# Altium project Sword.PrjPcb
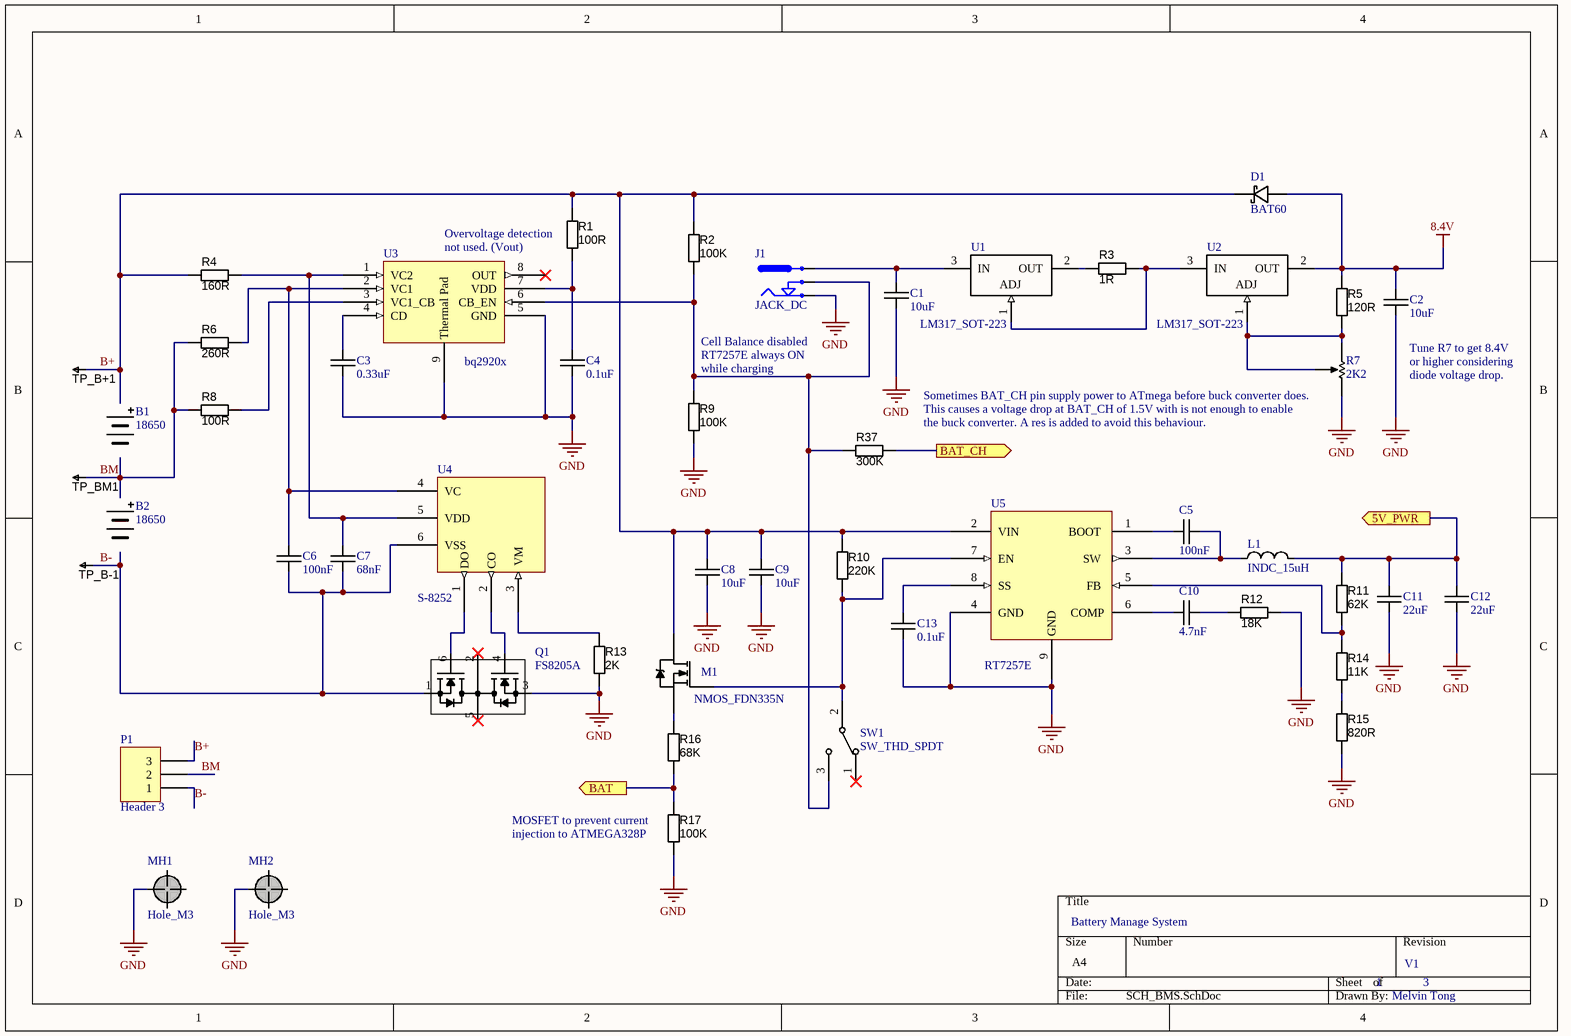
[diagram p0: SCH_BMS.SchDoc]
3 sheets, 112 parts. Net scope: global (net labels, ports and power ports of the same name join across sheets).
Board file: PCB_Sword.PcbDoc
Sheets:
  SCH_BMS.SchDoc
  SCH_System.SchDoc
  SCH_Modules.SchDoc

## Sheet SCH_BMS.SchDoc
size A4

### Parts
B1  18650
B2  18650
C1  10uF  [CAP_0805]
C2  10uF  [CAP_1206]
C3  0.33uF  [CAP_0805]
C4  0.1uF  [CAP_0805]
C5  100nF  [CAP_0805]
C6  100nF  [CAP_0805]
C7  68nF  [CAP_0805]
C8  10uF  [CAP_1206]
C9  10uF  [CAP_1206]
C10  4.7nF  [CAP_0805]
C11  22uF  [CAP_1206]
C12  22uF  [CAP_1206]
C13  0.1uF  [CAP_0805]
D1  BAT60  [SOD323]
J1  JACK_DC  [DC-004]
L1  INDC_15uH  [IND_15uH]
M1  NMOS_FDN335N  [SOT23_213]
MH1  Hole_M3  [Hole_M3]
MH2  Hole_M3  [Hole_M3]
P1  Header 3  [HDR1X3]
Q1  FS8205A  [SOT23-6]
R1  100R  [RESC3216X70N]
R2  100K  [RESC3216X70N]
R3  value 1R  [RESC6332X70N]  (hidden comment: RES_1R_2512)
R4  160R  [RESC3216X70N]
R5  120R  [RESC3216X70N]
R6  260R  [RESC3216X70N]
R7  2K2  [RES_VAR]
R8  100R  [RESC3216X70N]
R9  100K  [RESC3216X70N]
R10  220K  [RESC3216X70N]
R11  62K  [RESC3216X70N]
R12  18K  [RESC3216X70N]
R13  2K  [RESC3216X70N]
R14  11K  [RESC3216X70N]
R15  820R  [RESC3216X70N]
R16  68K  [RESC3216X70N]
R17  100K  [RESC3216X70N]
R37  300K  [RESC3216X70N]
SW1  SW_THD_SPDT  [3P_header]
TP_B+1  TESTPOINT  [TP-R20]  (value not drawn)  (no BOM)
TP_B-1  TESTPOINT  [TP-R20]  (value not drawn)  (no BOM)
TP_BM1  TESTPOINT  [TP-R20]  (value not drawn)  (no BOM)
U1  LM317_SOT-223  [SOT223]
U2  LM317_SOT-223  [SOT223]
U3  bq2920x  [bq2920x]
U4  S-8252  [SOT23-6]
U5  RT7257E  [RT7257E]

### Ports
5V_PWR (out), BAT (out), BAT_CH (out)

### Nets
5V_PWR: C11.1 C12.1 L1.2 R11.1 ; port 5V_PWR
8.4V: C2.1 D1.A R5.1 U2.2(OUT)
GND: C1.2 C2.2 C3.2 C4.2 C8.2 C9.2 C11.2 C12.2 C13.2 J1.1 MH1.MH MH2.MH Q1.3(D2) R7.3(CW) R9.1 R12.2 R13.2 R15.2 R17.2 U3.5(GND) U3.9(Thermal_Pad) U5.4(GND) U5.9(GND)
B+: C8.1 C9.1 D1.K M1.3(D) P1.3 R1.2 R2.2 R4.1 R10.1 TP_B+1.1 U5.2(VIN)
B-: C6.2 C7.2 P1.1 Q1.1(S1) TP_B-1.1 U4.6(VSS)
BAT: R16.2 R17.1 ; port BAT
BAT_CH: R37.2 ; port BAT_CH
BM: P1.2 R6.1 R8.1 TP_BM1.1
NetC1_1: C1.1 J1.2 U1.3(IN)
NetC3_1: C3.1 U3.4(CD)
NetC4_1: C4.1 R1.1 U3.7(VDD)
NetC5_1: C5.1 U5.1(BOOT)
NetC5_2: C5.2 L1.1 U5.3(SW)
NetC6_1: C6.1 R6.2 U3.2(VC1) U4.4(VC)
NetC7_1: C7.1 R4.2 U3.1(VC2) U4.5(VDD)
NetC10_1: C10.1 U5.6(COMP)
NetC10_2: C10.2 R12.1
NetC13_1: C13.1 U5.8(SS)
NetJ1_3: J1.3 R2.1 R9.2 R37.1 SW1.3 U3.6(CB_EN)
NetM1_1: M1.1(G) R10.2 SW1.2 U5.7(EN)
NetM1_2: M1.2(S) R16.1
NetQ1_4: Q1.4(G2) U4.2(CO)
NetQ1_6: Q1.6(G1) U4.1(DO)
NetR3_1: R3.1 U1.2(OUT)
NetR3_2: R3.2 U1.1(ADJ) U2.3(IN)
NetR5_2: R5.2 R7.1(CCW) R7.2(WIPER) U2.1(ADJ)
NetR8_2: R8.2 U3.3(VC1_CB)
NetR11_2: R11.2 R14.1 U5.5(FB)
NetR13_1: R13.1 U4.3(VM)
NetR14_2: R14.2 R15.1

Not connected (* = marked no-connect by the designer): Q1 2(D1)* 5(D2)*; SW1 1*; U3 8(OUT)*

### Notes on the sheet
- (near R1) Overvoltage detection
- not used. (Vout)
- Cell Balance disabled
- (near R9) while charging
- RT7257E always ON
- (near C2) Tune R7 to get 8.4V
- or higher considering
- diode voltage drop.
- (near R7) This causes a voltage drop at BAT_CH of 1.5V with is not enough to enable
- (near R7) Sometimes BAT_CH pin supply power to ATmega before buck converter does.
- the buck converter. A res is added to avoid this behaviour.
- (near R17) MOSFET to prevent current
- (near R17) injection to ATMEGA328P
- Battery Manage System
- 1
- V1
- 3
- Melvin Tong

### Library data of the parts
B1 B2 = Battery_18650
C1 C2 C8 C9 = CAP_10uF: SMD 0805/1206
C3 = CAP_330nF: SMD 0805
C4 C6 C7 C13 = CAP_0.1uF: SMD 0805
C5 = CAP_100nF: SMD 0805
C10 = CAP_4.7nF: SMD 0805
C11 C12 = CAP_22uF: SMD 1206
D1 = BAT60: Schottky Diode 3A, Vf~0.24V, Vr=10V
L1 = INDC_15uH: 15uH ±20% 4.2A 28.4mΩ SMD,12.5x12.5x6.5mm Power Inductors
P1 = Header 3: Header, 3-Pin; LatestRevisionDate: 17-Jul-2002; LatestRevisionNote: Re-released for DXP Platform.; Publisher: Altium Limited
Q1 = FS8205A: NMOS, Drain-Connected, Imax 6A
R1 R8 = RES_100R: Resistor SMD, 1206; Value: N/A
R2 R9 R17 = RES_100K: Resistor SMD, 1206; Value: N/A
R3 = RES_1R_2512: Resistor SMD 1Ω ±5% 2W ±400ppm/℃ 2512; Ratings: 1W; SCDType: spec; Tolerance: ±5%; Material: Thick Film; Package / Case: 2512 (6332 metric)
R4 = RES_160R: Resistor SMD, 1206; Value: N/A
R5 = RES_120R: Resistor SMD, 1206; Value: N/A
R6 = RES_260R: Resistor SMD, 1206; Value: N/A
R7 = RES_Var_2K2: Resistor SMD Variable
R10 = RES_220K: Resistor SMD, 1206; Value: N/A
R11 = RES_62K: Resistor SMD, 1206; Value: N/A
R12 = RES_18K: Resistor SMD, 1206; Value: N/A
R13 = RES_2K: Resistor SMD, 1206; Value: N/A
R14 = RES_11K: Resistor SMD, 1206; Value: N/A
R15 = RES_820R: Resistor SMD, 1206; Value: N/A
R16 = RES_68K: Resistor SMD, 1206; Value: N/A
R37 = RES_300K: Resistor SMD, 1206; Value: N/A
SW1 = SW_THD_SPDT: Switch 2 position
TP_B+1 TP_B-1 TP_BM1 = TESTPOINT: SMD test pin
U1 U2 = LM317_SOT-223: Linear Voltage Regulator
U3 = bq2920x: Automatic Cell Balance 2S Li-Ion Battery
U4 = S-8252: Battery protection IC for 2S battery pack
U5 = RT7257E: DC/DC Buck Converter, 3A, 4.5V-17V Vin

## Sheet SCH_System.SchDoc
size A4
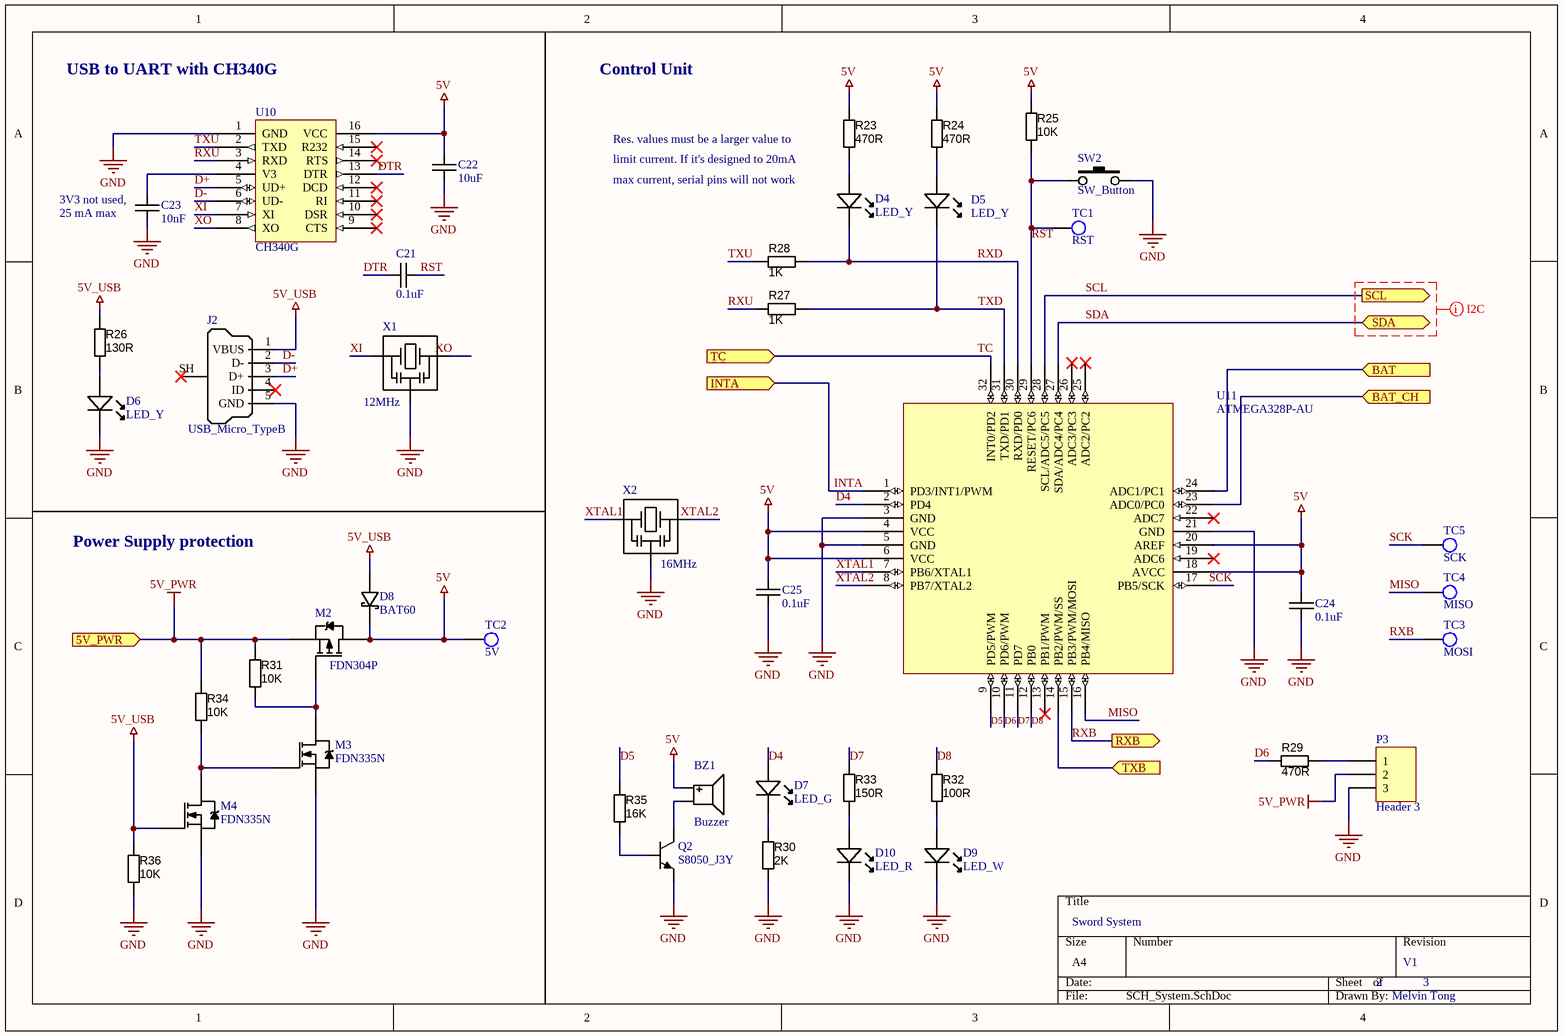
[diagram p1: SCH_System.SchDoc]

### Parts
BZ1  Buzzer  [Buzzer]
C21  0.1uF  [CAP_0805]
C22  10uF  [CAP_1206]
C23  10nF  [CAP_0805]
C24  0.1uF  [CAP_0805]
C25  0.1uF  [CAP_0805]
D4  LED_Y  [LED-0603-YELLOW]
D5  LED_Y  [LED-0603-YELLOW]
D6  LED_Y  [LED-0603-YELLOW]
D7  LED_G  [LED_0805]
D8  BAT60  [SOD323]
D9  LED_W  [LED_0805]
D10  LED_R  [LED_0805]
J2  USB_Micro_TypeB  [USB_Micro_TypeB]
M2  FDN304P  [SOT23_213]
M3  FDN335N  [SOT23_213]
M4  FDN335N  [SOT23_213]
P3  Header 3  [HDR1X3]
Q2  S8050_J3Y  [SOT23_213]
R23  470R  [RESC3216X70N]
R24  470R  [RESC3216X70N]
R25  10K  [RESC3216X70N]
R26  130R  [RESC3216X70N]
R27  1K  [RESC3216X70N]
R28  1K  [RESC3216X70N]
R29  470R  [RESC3216X70N]
R30  2K  [RESC3216X70N]
R31  10K  [RESC3216X70N]
R32  100R  [RESC3216X70N]
R33  150R  [RESC3216X70N]
R34  10K  [RESC3216X70N]
R35  16K  [RESC3216X70N]
R36  10K  [RESC3216X70N]
SW2  SW_Button  [Button_4x4x1.5]
TC1  RST  [TP_15]
TC2  5V  [TP_15]
TC3  MOSI  [TP_15]
TC4  MISO  [TP_15]
TC5  SCK  [TP_15]
U10  CH340G  [CH340G]
U11  ATMEGA328P-AU  [ATMEGA328P-AU]
X1  12MHz  [XTAL_3.2x1.6]
X2  16MHz  [XTAL_16MHz]

### Ports
5V_PWR (in), BAT (in), BAT_CH (in), INTA (in), RXB (out), SCL (out), SDA (bidir), TC (in), TXB (in)

### Nets
5V: BZ1.1(Positive) C22.1 C24.2 C25.2 D8.K M2.3(D) R23.2 R24.1 R25.1 TC2.1 U10.16(VCC) U11.4(VCC) U11.6(VCC) U11.18(AVCC) U11.20(AREF)
5V_PWR: M2.2(S) P3.2 R31.1 R34.1 ; port 5V_PWR
5V_USB: D8.A J2.1(VBUS) M4.1(G) R26.2 R36.1
GND: C22.2 C23.2 C24.1 C25.1 D6.K D9.K D10.K J2.5(GND) M3.2(S) M4.2(S) P3.3 Q2.2(E) R30.2 R36.2 SW2.2 U10.1(GND) U11.3(GND) U11.5(GND) U11.21(GND) X1.2(GND) X2.2(GND)
BAT: U11.24(ADC1/PC1) ; port BAT
BAT_CH: U11.23(ADC0/PC0) ; port BAT_CH
D4: D7.A U11.2(PD4)
D5: R35.1 U11.9(PD5/PWM)
D6: R29.2 U11.10(PD6/PWM)
D7: R33.1 U11.11(PD7)
D8: R32.2 U11.12(PB0)
D+: J2.3(D+) U10.5(UD+)
D-: J2.2(D-) U10.6(UD-)
DTR: C21.1 U10.13(DTR)
INTA: U11.1(PD3/INT1/PWM) ; port INTA
MISO: TC4.1 U11.16(PB4/MISO)
RST: C21.2 R25.2 SW2.1 TC1.1 U11.29(RESET/PC6)
RXB: TC3.1 U11.15(PB3/PWM/MOSI) ; port RXB
RXD: D4.K R28.2 U11.30(RXD/PD0)
RXU: R27.1 U10.3(RXD)
SCK: TC5.1 U11.17(PB5/SCK)
SCL: U11.28(SCL/ADC5/PC5) ; port SCL
SDA: U11.27(SDA/ADC4/PC4) ; port SDA
TC: U11.32(INT0/PD2) ; port TC
TXB: U11.14(PB2/PWM/SS) ; port TXB
TXD: D5.K R27.2 U11.31(TXD/PD1)
TXU: R28.1 U10.2(TXD)
XI: U10.7(XI) X1.1(IN)
XO: U10.8(XO) X1.3(OUT)
XTAL1: U11.7(PB6/XTAL1) X2.1(IN)
XTAL2: U11.8(PB7/XTAL2) X2.3(OUT)
NetBZ1_2: BZ1.2(Negative) Q2.3(C)
NetC23_1: C23.1 U10.4(V3)
NetD4_A: D4.A R23.1
NetD5_A: D5.A R24.2
NetD6_A: D6.A R26.1
NetD7_K: D7.K R30.1
NetD9_A: D9.A R32.1
NetD10_A: D10.A R33.2
NetM2_1: M2.1(G) M3.3(D) R31.2
NetM3_1: M3.1(G) M4.3(D) R34.2
NetP3_1: P3.1 R29.1
NetQ2_1: Q2.1(B) R35.2

Not connected (* = marked no-connect by the designer): J2 4(ID)* SH(Shell)*; U10 9(CTS)* 10(DSR)* 11(RI)* 12(DCD)* 14(RTS)* 15(R232)*; U11 13(PB1/PWM)* 19(ADC6)* 22(ADC7)* 25(ADC2/PC2)* 26(ADC3/PC3)*

### Layout directives
net class I2C: (no net found under the mark)

### Notes on the sheet
- USB to UART with CH340G
- Control Unit
- (near R23) Res. values must be a larger value to
- (near R23) limit current. If it's designed to 20mA
- (near C23) 3V3 not used,
- (near C23) 25 mA max
- (near D4) max current, serial pins will not work
- Power Supply protection
- Sword System
- 2
- V1
- 3
- Melvin Tong

### Library data of the parts
BZ1 = Buzzer: Buzzer passive 5 VAC
C21 C24 C25 = CAP_0.1uF: SMD 0805
C22 = CAP_10uF: SMD 0805/1206
C23 = CAP_10nF: SMD 0805
D4-D6 = LED_Y: SMD_0603 2.4V
D7 = LED_G: SMD_0805 3V
D8 = BAT60: Schottky Diode 3A, Vf~0.24V, Vr=10V
D9 = LED_W: SMD_0805 3V
D10 = LED_R: SMD_0805 2V
M2 = PMOS
M3 M4 = NMOS
P3 = Header 3: Header, 3-Pin; LatestRevisionDate: 17-Jul-2002; LatestRevisionNote: Re-released for DXP Platform.; Publisher: Altium Limited
Q2 = NPN
R23 R24 R29 = RES_470R: Resistor SMD, 1206; Value: N/A
R25 R31 R34 R36 = RES_10K: Resistor SMD, 1206; Value: N/A
R26 = RES_130R: Resistor SMD, 1206; Value: N/A
R27 R28 = RES_1K: Resistor SMD, 1206; Value: N/A
R30 = RES_2K: Resistor SMD, 1206; Value: N/A
R32 = RES_100R: Resistor SMD, 1206; Value: N/A
R33 = RES_150R: Resistor SMD, 1206; Value: N/A
R35 = RES_16K: Resistor SMD, 1206; Value: N/A
TC1-TC5 = TESTCONN
X1 = 12MHz: Crystal Oscillator
X2 = 16MHz: Crystal Oscillator

## Sheet SCH_Modules.SchDoc
size A4
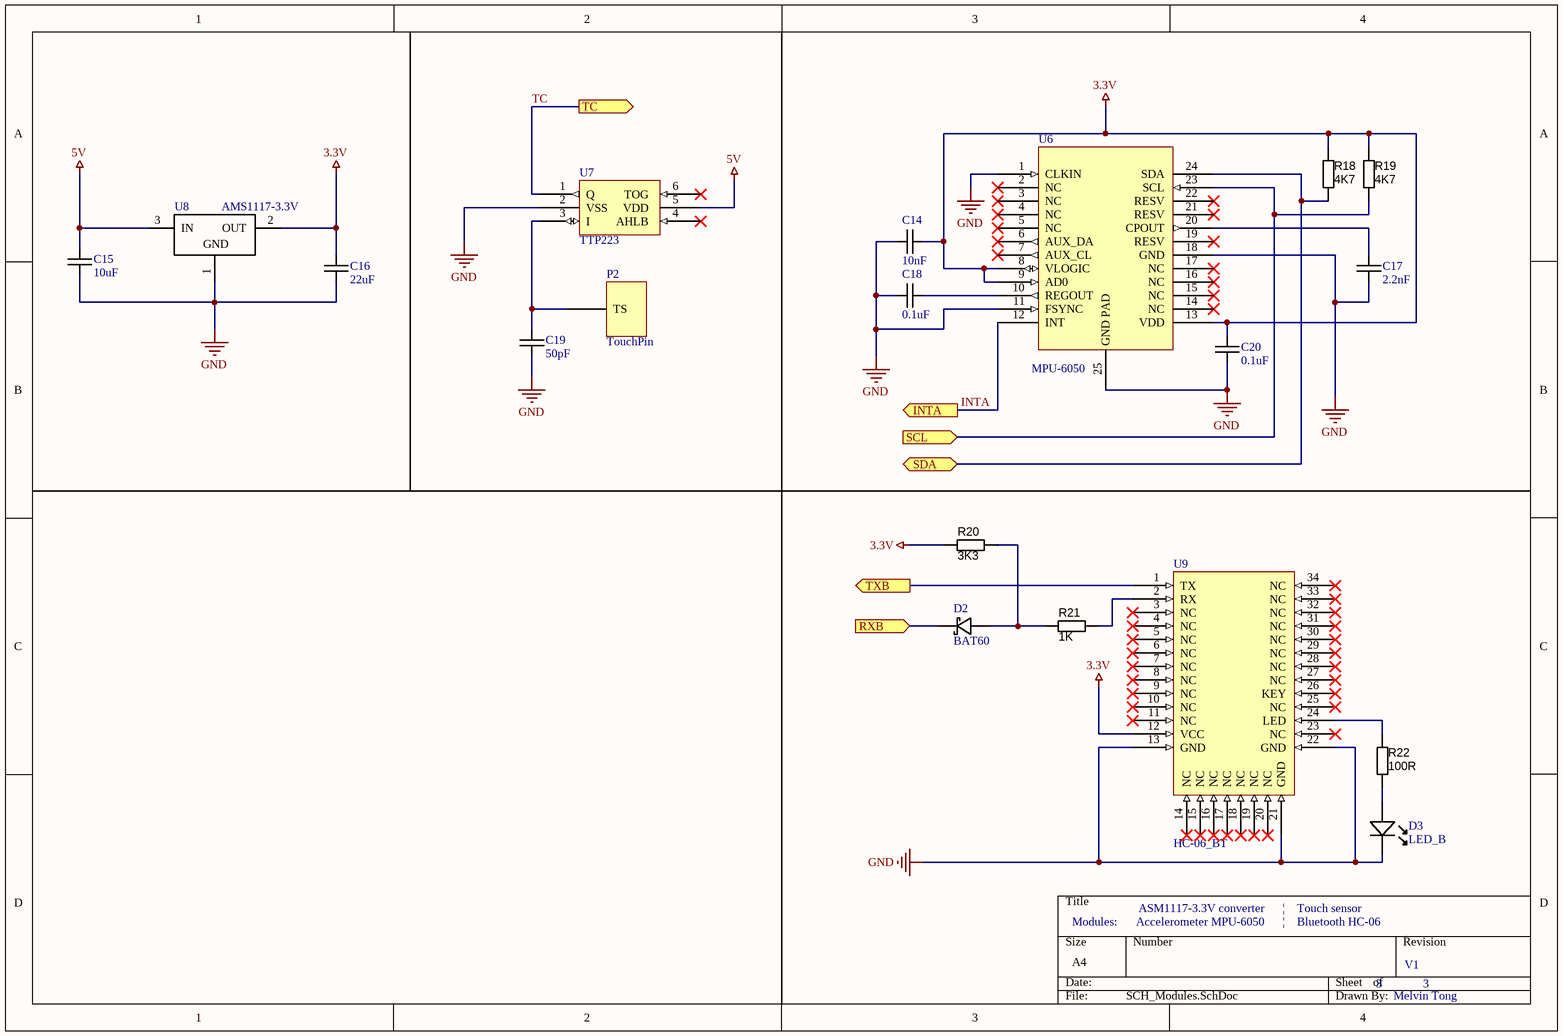
[diagram p2: SCH_Modules.SchDoc]

### Parts
C14  10nF  [CAP_0805]
C15  10uF  [CAP_1206]
C16  22uF  [CAP_1206]
C17  2.2nF  [CAP_0805]
C18  0.1uF  [CAP_0805]
C19  50pF  [CAP_0805]
C20  0.1uF  [CAP_0805]
D2  BAT60  [SOD323]
D3  LED_B  [LED_0805]
P2  TouchPin  [TouchPad]
R18  4K7  [RESC3216X70N]
R19  4K7  [RESC3216X70N]
R20  3K3  [RESC3216X70N]
R21  1K  [RESC3216X70N]
R22  100R  [RESC3216X70N]
U6  MPU-6050  [MPU-6050]
U7  TTP223  [TTP223-BA6]
U8  AMS1117-3.3V  [SOT223]
U9  HC-06_BT  [HC-06_BT]

### Ports
INTA (out), RXB (in), SCL (in), SDA (bidir), TC (out), TXB (out)

### Nets
3.3V: C14.2 C16.1 C20.2 R18.1 R19.1 R20.1 U6.8(VLOGIC) U6.9(AD0) U6.13(VDD) U8.2(OUT) U9.12(VCC)
5V: C15.1 U7.5(VDD) U8.3(IN)
GND: C14.1 C15.2 C16.2 C17.2 C18.1 C19.2 C20.1 D3.K U6.1(CLKIN) U6.11(FSYNC) U6.18(GND) U6.25(GND_PAD) U7.2(VSS) U8.1(ADJ) U9.13(GND) U9.21(GND) U9.22(GND)
INTA: U6.12(INT) ; port INTA
RXB: D2.K ; port RXB
SCL: R19.2 U6.23(SCL) ; port SCL
SDA: R18.2 U6.24(SDA) ; port SDA
TC: U7.1(Q) ; port TC
TXB: U9.1(TX) ; port TXB
NetC17_1: C17.1 U6.20(CPOUT)
NetC18_2: C18.2 U6.10(REGOUT)
NetC19_1: C19.1 P2.1(TS) U7.3(I)
NetD2_A: D2.A R20.2 R21.1
NetD3_A: D3.A R22.2
NetR21_2: R21.2 U9.2(RX)
NetR22_1: R22.1 U9.24(LED)

Not connected (* = marked no-connect by the designer): U6 2(NC)* 3(NC)* 4(NC)* 5(NC)* 6(AUX_DA)* 7(AUX_CL)* 14(NC)* 15(NC)* 16(NC)* 17(NC)* 19(RESV)* 21(RESV)* 22(RESV)*; U7 4(AHLB_)* 6(TOG_)*; U9 3(NC)* 4(NC)* 5(NC)* 6(NC)* 7(NC)* 8(NC)* 9(NC)* 10(NC)* 11(NC)* 14(NC)* 15(NC)* 16(NC)* 17(NC)* 18(NC)* 19(NC)* 20(NC)* 23(NC)* 25(NC)* 26(KEY)* 27(NC)* 28(NC)* 29(NC)* 30(NC)* 31(NC)* 32(NC)* 33(NC)* 34(NC)*

### Notes on the sheet
- Modules:
- Accelerometer MPU-6050      |    Bluetooth HC-06
- ASM1117-3.3V converter      |    Touch sensor
- 3
- V1
- Melvin Tong
- (in symbol AMS1117-3.3V) GND

### Library data of the parts
C14 = CAP_10nF: SMD 0805
C15 = CAP_10uF: SMD 0805/1206
C16 = CAP_22uF: SMD 1206
C17 = CAP_2.2nF: SMD 0805
C18 C20 = CAP_0.1uF: SMD 0805
C19 = CAP_50pF: SMD 0805
D2 = BAT60: Schottky Diode 3A, Vf~0.24V, Vr=10V
D3 = LED_B: SMD_0805 3V
R18 R19 = RES_4K7: Resistor SMD, 1206; Value: N/A
R20 = RES_3K3: Resistor SMD, 1206; Value: N/A
R21 = RES_1K: Resistor SMD, 1206; Value: N/A
R22 = RES_100R: Resistor SMD, 1206; Value: N/A

## Nets that join several sheets
5V: SCH_System (15 pins), SCH_Modules (C15.1 U7.5 U8.3)
5V_PWR: SCH_BMS (C11.1 C12.1 L1.2 R11.1), SCH_System (M2.2 P3.2 R31.1 R34.1)
GND: SCH_BMS (23 pins), SCH_System (21 pins), SCH_Modules (17 pins)
BAT: SCH_BMS (R16.2 R17.1), SCH_System (U11.24)
BAT_CH: SCH_BMS (R37.2), SCH_System (U11.23)
INTA: SCH_System (U11.1), SCH_Modules (U6.12)
RXB: SCH_System (TC3.1 U11.15), SCH_Modules (D2.K)
SCL: SCH_System (U11.28), SCH_Modules (R19.2 U6.23)
SDA: SCH_System (U11.27), SCH_Modules (R18.2 U6.24)
TC: SCH_System (U11.32), SCH_Modules (U7.1)
TXB: SCH_System (U11.14), SCH_Modules (U9.1)